# EAGLE schematic msi0010_new (EAGLE 6.1)

## Sheet 1 of 3
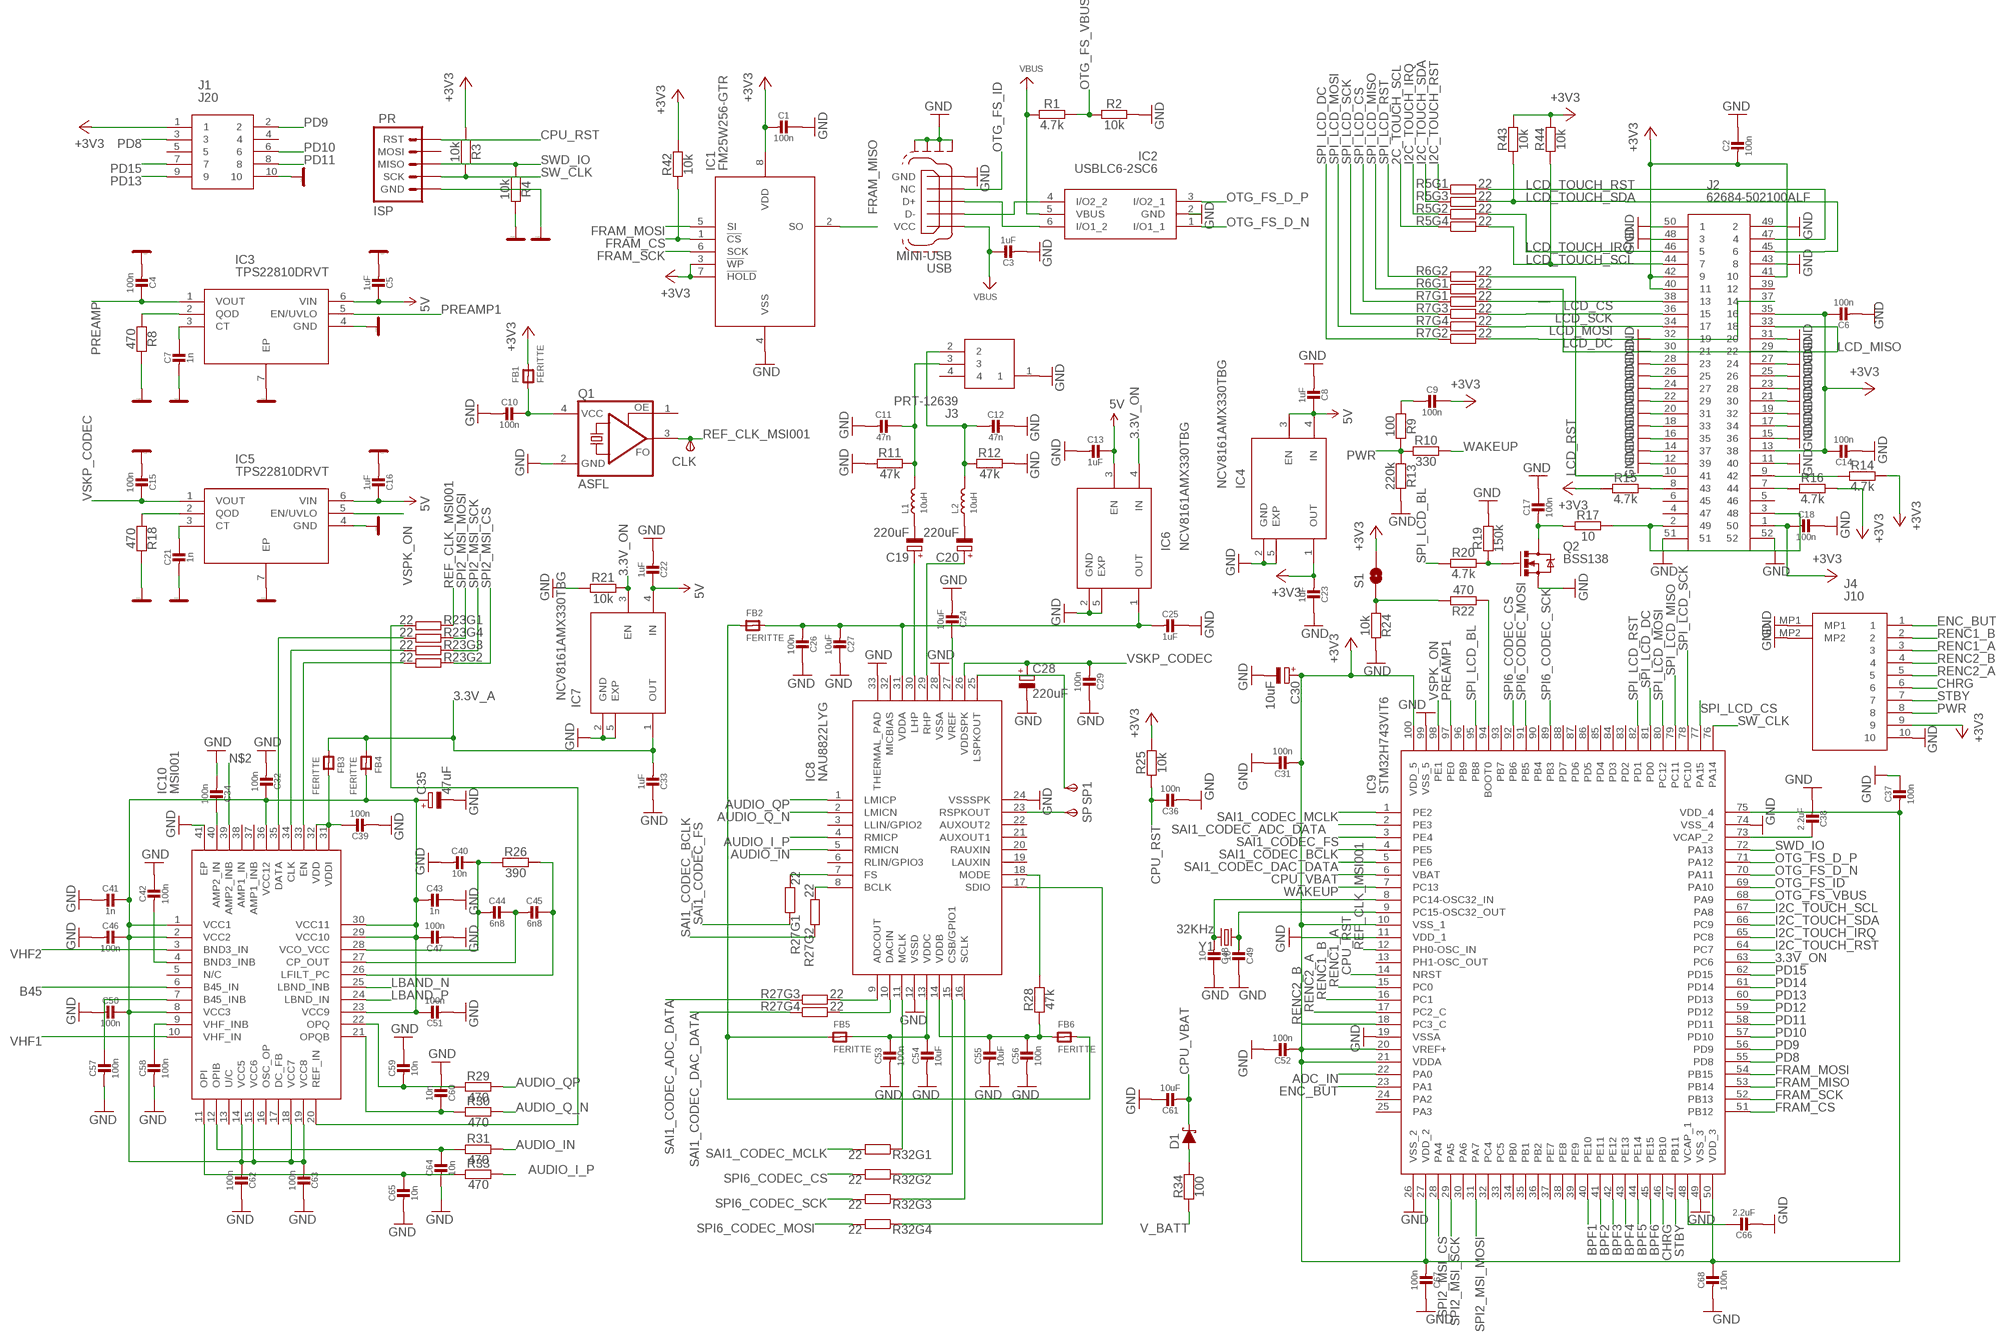
[diagram p0: schematic, sheet 1]

### Parts
C1  100n  CAP_CERAMIC_0402  [_0402]
C2  100n  CAP_CERAMIC_0402  [_0402]
C3  1uF  CAP_CERAMIC_0603  [_0603]
C4  100n  CAP_CERAMIC_0402  [_0402]
C5  1uF  CAP_CERAMIC_0603  [_0603]
C6  100n  CAP_CERAMIC_0402  [_0402]
C7  1n  CAP_CERAMIC_0402  [_0402]
C8  1uF  CAP_CERAMIC_0603  [_0603]
C9  100n  CAP_CERAMIC_0402  [_0402]
C10  100n  CAP_CERAMIC_0402  [_0402]
C11  47n  CAP_CERAMIC_0402  [_0402]
C12  47n  CAP_CERAMIC_0402  [_0402]
C13  1uF  CAP_CERAMIC_0603  [_0603]
C14  100n  CAP_CERAMIC_0402  [_0402]
C15  100n  CAP_CERAMIC_0402  [_0402]
C16  1uF  CAP_CERAMIC_0603  [_0603]
C17  100n  CAP_CERAMIC_0402  [_0402]
C18  100n  CAP_CERAMIC_0402  [_0402]
C19  220uF  CPOL-EUSANYO_A  [SANYO-OSCON_A]
C20  220uF  CPOL-EUSANYO_A  [SANYO-OSCON_A]
C21  1n  CAP_CERAMIC_0402  [_0402]
C22  1uF  CAP_CERAMIC_0603  [_0603]
C23  1uF  CAP_CERAMIC_0603  [_0603]
C24  10uF  CAP_CERAMIC_0402  [_0402]
C25  1uF  CAP_CERAMIC_0603  [_0603]
C26  100n  CAP_CERAMIC_0603  [_0603]
C27  10uF  CAP_CERAMIC_0402  [_0402]
C28  220uF  CPOL-EUSANYO_A  [SANYO-OSCON_A]
C29  100n  CAP_CERAMIC_0402  [_0402]
C30  10uF  CPOL-EUSMCA  [SMC_A]
C31  100n  CAP_CERAMIC_0402  [_0402]
C32  100n  CAP_CERAMIC_0402  [_0402]
C33  1uF  CAP_CERAMIC_0603  [_0603]
C34  100n  CAP_CERAMIC_0402  [_0402]
C35  47uF  CPOL-EUSMCA  [SMC_A]
C36  100n  CAP_CERAMIC_0402  [_0402]
C37  100n  CAP_CERAMIC_0402  [_0402]
C38  2.2uF  CAP_CERAMIC0805-NOTHERMALS  [0805_NOTHERMALS]
C39  100n  CAP_CERAMIC_0402  [_0402]
C40  10n  CAP_CERAMIC_0402  [_0402]
C41  1n  CAP_CERAMIC_0402  [_0402]
C42  100n  CAP_CERAMIC_0402  [_0402]
C43  1n  CAP_CERAMIC_0402  [_0402]
C44  6n8  CAP_CERAMIC_0402  [_0402]
C45  6n8  CAP_CERAMIC_0402  [_0402]
C46  100n  CAP_CERAMIC_0402  [_0402]
C47  100n  CAP_CERAMIC_0402  [_0402]
C48  10  CAP_CERAMIC_0402  [_0402]
C49  10  CAP_CERAMIC_0402  [_0402]
C50  100n  CAP_CERAMIC_0402  [_0402]
C51  100n  CAP_CERAMIC_0402  [_0402]
C52  100n  CAP_CERAMIC_0402  [_0402]
C53  100n  CAP_CERAMIC_0402  [_0402]
C54  10uF  CAP_CERAMIC_0603  [_0603]
C55  10uF  CAP_CERAMIC_0402  [_0402]
C56  100n  CAP_CERAMIC_0603  [_0603]
C57  100n  CAP_CERAMIC_0402  [_0402]
C58  100n  CAP_CERAMIC_0402  [_0402]
C59  10n  CAP_CERAMIC_0402  [_0402]
C60  10n  CAP_CERAMIC_0402  [_0402]
C61  10uF  CAP_CERAMIC_0402  [_0402]
C62  100n  CAP_CERAMIC_0402  [_0402]
C63  100n  CAP_CERAMIC_0402  [_0402]
C64  10n  CAP_CERAMIC_0402  [_0402]
C65  10n  CAP_CERAMIC_0402  [_0402]
C66  2.2uF  CAP_CERAMIC0805-NOTHERMALS  [0805_NOTHERMALS]
C67  100n  CAP_CERAMIC_0402  [_0402]
C68  100n  CAP_CERAMIC_0402  [_0402]
CLK  TPSTP13R  [TP13R]
D1  1A/40V/500mV  DIODE-SCHOTTKY-BAT20J  [SOD-323]
FB1  FERITTE  FERRITE_0603  [_0603]
FB2  FERITTE  FERRITE_0603  [_0603]
FB3  FERITTE  FERRITE_0603  [_0603]
FB4  FERITTE  FERRITE_0603  [_0603]
FB5  FERITTE  FERRITE_0603  [_0603]
FB6  FERITTE  FERRITE_0603  [_0603]
IC1  FM25W256-GTR  [SOT127P602X173-8N]
IC2  USBLC6-2SC6  [SOT95P280X145-6N]
IC3  TPS22810DRVT  [SON65P200X200X80-7N]
IC4  NCV8161AMX330TBG  NCP170AMX285TCG  [VREG_NCP170AMX285TCG]
IC5  TPS22810DRVT  [SON65P200X200X80-7N]
IC6  NCV8161AMX330TBG  NCP170AMX285TCG  [VREG_NCP170AMX285TCG]
IC7  NCV8161AMX330TBG  NCP170AMX285TCG  [VREG_NCP170AMX285TCG]
IC8  NAU8822LYG  [QFN50P500X500X80-33N]
IC9  STM32H743VIT6  [QFP50P1600X1600X160-100N]
IC10  MSI001  [QFN50P600X600X90-41N]
J1  J20  3220-10-0300-00-TR_3220-10-0300-00-TR  [3220-10-0300-00-TR_322010030000TR]
J2  62684-502100ALF  [62684502100ALF]
J3  PRT-12639  [PRT12639]
J4  J10  686120148922_686120148922  [686120148922_686120148922]
L1  10uH  INDUCTOR/FERRITE-BEAD-0805  [L0805@1]
L2  10uH  INDUCTOR/FERRITE-BEAD-0805  [L0805@1]
PR  ISP  SPARKFUN-CONNECTORS_PIC-ICSP-MINI  [SPARKFUN-CONNECTORS_PIC-ICSP-MINI]
Q1  ASFL  [ASF]
Q2  BSS138  MOSFET-NCHANNELBSS138  [SOT23-3]
R1  4.7k  RESISTORS-0402  [C0402]
R2  10k  RESISTORS-0402  [C0402]
R3  10k  RESISTORS-0402  [C0402]
R4  10k  RESISTORS-0402  [C0402]
R5  22  R_MATRIX_4ER_MATRIX_4_0402  [R_MATRIX_4_0402]
R6  22  R_MATRIX_4ER_MATRIX_4_0402  [R_MATRIX_4_0402]
R7  22  R_MATRIX_4ER_MATRIX_4_0402  [R_MATRIX_4_0402]
R8  470  RESISTORS-0402  [C0402]
R9  100  RESISTORS-0402  [C0402]
R10  330  RESISTORS-0402  [C0402]
R11  47k  RESISTORS-0402  [C0402]
R12  47k  RESISTORS-0402  [C0402]
R13  220k  RESISTORS-0402  [C0402]
R14  4.7k  RESISTORS-0402  [C0402]
R15  4.7k  RESISTORS-0402  [C0402]
R16  4.7k  RESISTORS-0402  [C0402]
R17  10  RESISTORS-0805  [C0805]
R18  470  RESISTORS-0402  [C0402]
R19  150k  RESISTORS-0402  [C0402]
R20  4.7k  RESISTORS-0402  [C0402]
R21  10k  RESISTORS-0402  [C0402]
R22  470  RESISTORS-0402  [C0402]
R23  22  R_MATRIX_4ER_MATRIX_4_0402  [R_MATRIX_4_0402]
R24  10k  RESISTORS-0402  [C0402]
R25  10k  RESISTORS-0402  [C0402]
R26  390  RESISTORS-0402  [C0402]
R27  22  R_MATRIX_4ER_MATRIX_4_0402  [R_MATRIX_4_0402]
R28  47k  RESISTORS-0402  [C0402]
R29  470  RESISTORS-0402  [C0402]
R30  470  RESISTORS-0402  [C0402]
R31  470  RESISTORS-0402  [C0402]
R32  22  R_MATRIX_4ER_MATRIX_4_0402  [R_MATRIX_4_0402]
R33  470  RESISTORS-0402  [C0402]
R34  100  RESISTORS-0402  [C0402]
R42  10k  RESISTORS-0402  [C0402]
R43  10k  RESISTORS-0402  [C0402]
R44  10k  RESISTORS-0402  [C0402]
S1  SOLDERJUMPERNO  [SJ_2S-NO]
SP  TPSTP15R  [TP15R]
SP1  TPSTP15R  [TP15R]
USB  MINI-USB  [MINI-USB-B5]
Y1  32KHz  CRYSTALMS3V  [CRYSTAL-32KHZ-MS3V]

### Nets
2C_TOUCH_SCL: R5.4.1
3.3V_A: C33.2 FB3.1 FB4.1 IC7.1(OUT) ; also sheet 2
3.3V_ON: IC6.4(IN) IC7.3(EN) IC9.63(PC6) R21.2
5V: C5.1 C8.1 C13.1 C16.1 C22.1 IC3.6(VIN) IC4.3(EN) IC4.4(IN) IC5.6(VIN) IC6.3(EN) IC7.4(IN) ; also sheet 3
+3V3: C1.2 C2.2 C6.1 C9.1 C14.1 C18.2 C23.2 C30.+ C31.2 C37.2 C52.2 C67.2 C68.1 FB1.2 IC1.3(!WP) IC1.7(!HOLD) IC1.8(VDD) IC4.1(OUT) IC9.10(VSS_1) IC9.20(VREF+) IC9.21(VDDA) IC9.27(VDD_2) IC9.50(VDD_3) IC9.75(VDD_4) IC9.100(VDD_5) J1.1 J2.1 J2.13 J2.35 J2.40 J2.41 J2.42 J4.9 R3.1 R14.2 R15.1 R16.2 R25.2 R42.2 R43.2 R44.2 S1.2 ; also sheet 2,3
-: IC8.25(LSPKOUT) SP1.TP(PP)
ADC_IN: IC9.22(PA0) ; also sheet 3
AUDIO_I_P: IC8.4(RMICP) R33.2
AUDIO_IN: IC8.5(RMICN) R31.2
AUDIO_Q_N: IC8.2(LMICN) R30.2
AUDIO_QP: IC8.1(LMICP) R29.2
B45: IC10.6(B45_IN) ; also sheet 2
BPF1: IC9.40(PE10) ; also sheet 2
BPF2: IC9.41(PE11) ; also sheet 2
BPF3: IC9.42(PE12) ; also sheet 2
BPF4: IC9.43(PE13) ; also sheet 2
BPF5: IC9.44(PE14) ; also sheet 2
BPF6: IC9.45(PE15) ; also sheet 2
CHRG: IC9.46(PB10) J4.6 ; also sheet 3
CPU_RST: C36.1 IC9.14(NRST) PR.1(RST) R25.1
CPU_VBAT: C61.2 D1.C IC9.6(VBAT)
ENC_BUT: IC9.23(PA1) J4.1
FRAM_CS: IC1.1(!CS) IC9.51(PB12) R42.1
FRAM_MISO: IC1.2(SO) IC9.53(PB14)
FRAM_MOSI: IC1.5(SI) IC9.54(PB15)
FRAM_SCK: IC1.6(SCK) IC9.52(PB13)
GND: C1.1 C2.1 C3.2 C4.2 C5.2 C6.2 C7.2 C8.2 C10.2 C11.2 C12.1 C13.2 C14.2 C15.2 C16.2 C17.1 C18.1 C21.2 C22.2 C23.1 C24.2 C25.1 C26.1 C27.1 C28.- C29.1 C30.- C31.1 C32.2 C33.1 C34.2 C35.- C36.2 C37.1 C38.2 C39.2 C40.2 C41.2 C42.1 C43.1 C46.2 C47.2 C48.1 C49.1 C50.2 C51.2 C52.1 C53.2 C54.2 C55.2 C56.2 C57.2 C58.2 C59.1 C60.2 C61.1 C62.1 C63.1 C64.2 C65.2 C66.2 C67.1 C68.2 IC1.4(VSS) IC2.2(GND) IC3.4(GND) IC3.7(EP) IC4.2(GND) IC4.5(EXP) IC5.4(GND) IC5.7(EP) IC6.2(GND) IC6.5(EXP) IC7.2(GND) IC7.5(EXP) IC8.12(VSSD) IC8.24(VSSSPK) IC8.28(VSSA) IC8.33(THERMAL_PAD) IC9.11(VDD_1) IC9.19(VSSA) IC9.26(VSS_2) IC9.49(VSS_3) IC9.74(VSS_4) IC9.99(VSS_5) IC10.41(EP) J1.10 J2.11 J2.12 J2.14 J2.15 J2.16 J2.17 J2.18 J2.19 J2.20 J2.21 J2.22 J2.23 J2.24 J2.25 J2.26 J2.27 J2.28 J2.29 J2.30 J2.31 J2.32 J2.43 J2.48 J2.49 J2.50 J2.51 J2.52 J3.1 J4.10 J4.MP1 J4.MP2 PR.5(GND) Q1.2(GND) Q2.2(S) R2.2 R4.2 R8.2 R11.1 R12.2 R13.2 R18.2 R19.2 R21.1 R24.2 USB.5(GND) USB.M1(S1) USB.M2(S2) USB.M3(S3) USB.M4(S4) ; also sheet 2,3
I2C_TOUCH_IRQ: IC9.65(PC8) R5.2.1
I2C_TOUCH_RST: IC9.64(PC7) R5.1.1
I2C_TOUCH_SCL: IC9.67(PA8)
I2C_TOUCH_SDA: IC9.66(PC9) R5.3.1
IO15: C48.2 IC9.8(PC14-OSC32_IN) Y1.P$2
IO16: C49.2 IC9.9(PC15-OSC32_OUT) Y1.P$1
LBAND_N: IC10.25(LBND_INB) ; also sheet 2
LBAND_P: IC10.24(LBND_IN) ; also sheet 2
LCD_CS: J2.38 R7.1.2
LCD_DC: J2.37 R7.2.2
LCD_MISO: J2.33 R6.1.2
LCD_MOSI: J2.34 R7.4.2
LCD_RST: J2.10 R6.2.2
LCD_SCK: J2.36 R7.3.2
LCD_TOUCH_IRQ: J2.46 R5.2.2
LCD_TOUCH_RST: J2.47 R5.1.2
LCD_TOUCH_SCL: J2.44 R5.4.2 R44.1
LCD_TOUCH_SDA: J2.45 R5.3.2 R43.1
N$1: C34.1 IC10.40(AMP2_IN)
N$2: IC10.39(AMP2_INB) ; also sheet 2
N$3: C39.1 FB3.2 IC10.31(VDDI) IC10.32(VDD)
N$5: C32.1 C35.+ C41.1 C43.2 C46.1 C47.1 C50.1 C51.1 C62.2 C63.2 FB4.2 IC10.1(VCC1) IC10.2(VCC2) IC10.8(VCC3) IC10.14(VCC5) IC10.15(VCC6) IC10.18(VCC7) IC10.19(VCC8) IC10.23(VCC9) IC10.29(VCC10) IC10.30(VCC11) IC10.36(VCC12)
N$6: C64.1 IC10.12(OPIB) R31.1
N$7: C65.1 IC10.11(OPI) R33.1
N$8: C60.1 IC10.21(OPQB) R30.1
N$9: C59.2 IC10.22(OPQ) R29.1
N$11: C21.1 IC5.3(CT)
N$17: C10.1 FB1.1 Q1.4(VCC)
N$26: C42.2 IC10.4(BND3_INB)
N$27: C58.1 IC10.9(VHF_INB)
N$28: C57.1 IC10.7(B45_INB)
N$29: IC10.33(EN) R23.2.2
N$30: IC10.34(CLK) R23.3.2
N$31: IC10.35(DATA) R23.4.2
N$32: C40.1 C44.2 IC10.28(VCO_VCC) R26.1
N$33: C44.1 C45.2 IC10.27(CP_OUT)
N$34: C45.1 IC10.26(LFILT_PC) R26.2
N$46: C19.+ IC8.30(LHP)
N$47: IC10.20(REF_IN) R23.1.2
N$48: C24.1 IC8.27(VREF)
N$49: C25.2 C26.2 C27.2 FB2.2 IC6.1(OUT) IC8.31(VDDA)
N$50: C53.1 C54.1 FB5.2 IC8.13(VDDC)
N$51: FB2.1 FB5.1 FB6.2
N$52: C55.1 C56.1 FB6.1 IC8.14(VDDB) R28.1
N$53: IC8.18(MODE) R28.2
N$54: C20.+ IC8.29(RHP)
N$55: IC8.7(FS) R27.1.2
N$56: IC8.8(BCLK) R27.2.2
N$57: IC8.9(ADCOUT) R27.3.2
N$58: IC8.10(DACIN) R27.4.2
N$59: C7.1 IC3.3(CT)
N$60: IC5.2(QOD) R18.1
N$61: IC8.15(CSB/GPIO1) R32.2.1
N$62: IC8.11(MCLK) R32.1.1
N$63: IC8.16(SCLK) R32.3.1
N$64: IC8.17(SDIO) R32.4.1
N$65: C19.- L1.1
N$66: C20.- L2.1
N$67: C12.2 J3.2 L2.2 R12.1
N$68: IC3.2(QOD) R8.1
N$69: C11.1 J3.3 L1.2 R11.2
N$70: IC2.6(I/O1_2) USB.3(D+)
N$73: J2.2 J2.3 R17.2
N$78: J2.7 R16.1
N$79: C17.2 Q2.3(D) R17.1
N$80: Q2.1(G) R19.1 R20.2
N$81: J2.9 R14.1
N$82: J2.8 R15.2
N$84: C66.1 IC9.48(VCAP_1)
N$85: C38.1 IC9.73(VCAP_2)
N$87: IC8.23(RSPKOUT) SP.TP(PP)
N$90: IC2.4(I/O2_2) USB.2(D-)
N$91: R22.2 R24.1 S1.1
N$92: IC9.94(BOOT0) R22.1
N$93: C9.2 R9.1
OTG_FS_D_N: IC2.1(I/O1_1) IC9.70(PA11)
OTG_FS_D_P: IC2.3(I/O2_1) IC9.71(PA12)
OTG_FS_ID: IC9.69(PA10) USB.4(NC)
OTG_FS_VBUS: IC9.68(PA9) R1.2 R2.1
PD8: IC9.55(PD8) J1.3
PD9: IC9.56(PD9) J1.2
PD10: IC9.57(PD10) J1.6
PD11: IC9.58(PD11) J1.8
PD12: IC9.59(PD12)
PD13: IC9.60(PD13) J1.9
PD14: IC9.61(PD14)
PD15: IC9.62(PD15) J1.7
PREAMP: C4.1 IC3.1(VOUT) ; also sheet 2
PREAMP1: IC3.5(EN/UVLO) IC9.97(PE0) ; also sheet 2
PWR: J4.8 R9.2 R10.1 R13.1
REF_CLK_MSI001: CLK.TP(PP) IC9.12(PH0-OSC_IN) Q1.3(FO) R23.1.1
RENC1_A: IC9.15(PC0) J4.3
RENC1_B: IC9.16(PC1) J4.2
RENC2_A: IC9.17(PC2_C) J4.5
RENC2_B: IC9.18(PC3_C) J4.4
SAI1_CODEC_ADC_DATA: IC9.2(PE3) R27.3.1
SAI1_CODEC_BCLK: IC9.4(PE5) R27.2.1
SAI1_CODEC_DAC_DATA: IC9.5(PE6) R27.4.1
SAI1_CODEC_FS: IC9.3(PE4) R27.1.1
SAI1_CODEC_MCLK: IC9.1(PE2) R32.1.2
SPI2_MSI_CS: IC9.28(PA4) R23.2.1
SPI2_MSI_MOSI: IC9.31(PA7) R23.4.1
SPI2_MSI_SCK: IC9.29(PA5) R23.3.1
SPI6_CODEC_CS: IC9.92(PB6) R32.2.2
SPI6_CODEC_MOSI: IC9.91(PB5) R32.4.2
SPI6_CODEC_SCK: IC9.89(PB3) R32.3.2
SPI_LCD_BL: IC9.95(PB8) R20.1
SPI_LCD_CS: IC9.77(PA15) R7.1.1
SPI_LCD_DC: IC9.81(PD0) R7.2.1
SPI_LCD_MISO: IC9.79(PC11) R6.1.1
SPI_LCD_MOSI: IC9.80(PC12) R7.4.1
SPI_LCD_RST: IC9.82(PD1) R6.2.1
SPI_LCD_SCK: IC9.78(PC10) R7.3.1
STBY: IC9.47(PB11) J4.7 ; also sheet 3
SW_CLK: IC9.76(PA14) PR.4(SCK) R3.2
SWD_IO: IC9.72(PA13) PR.3(MISO) R4.1
V_BATT: R34.1 ; also sheet 3
VBUS: C3.1 IC2.5(VBUS) R1.1 USB.1(VCC) ; also sheet 3
VBUS1: D1.A R34.2
VHF1: IC10.10(VHF_IN) ; also sheet 2
VHF2: IC10.3(BND3_IN) ; also sheet 2
VSKP_CODEC: C15.1 C28.+ C29.2 IC5.1(VOUT) IC8.26(VDDSPK)
VSPK_ON: IC5.5(EN/UVLO) IC9.98(PE1)
WAKEUP: IC9.7(PC13) R10.2
Unconnected: IC8.3(LLIN/GPIO2) IC8.6(RLIN/GPIO3) IC8.19(LAUXIN) IC8.20(RAUXIN) IC8.21(AUXOUT1) IC8.22(AUXOUT2) IC8.32(MICBIAS) IC9.13(PH1-OSC_OUT) IC9.24(PA2) IC9.25(PA3) IC9.30(PA6) IC9.32(PC4) IC9.33(PC5) IC9.34(PB0) IC9.35(PB1) IC9.36(PB2) IC9.37(PE7) IC9.38(PE8) IC9.39(PE9) IC9.83(PD2) IC9.84(PD3) IC9.85(PD4) IC9.86(PD5) IC9.87(PD6) IC9.88(PD7) IC9.90(PB4) IC9.93(PB7) IC9.96(PB9) IC10.5(N/C) IC10.13(U/C) IC10.16(OSC_OP) IC10.17(DC_FB) IC10.37(AMP1_INB) IC10.38(AMP1_IN) J1.4 J1.5 J2.4 J2.5 J2.6 J2.39 J3.4 PR.2(MOSI) Q1.1(OE) R6.3.1 R6.3.2 R6.4.1 R6.4.2

## Sheet 2 of 3
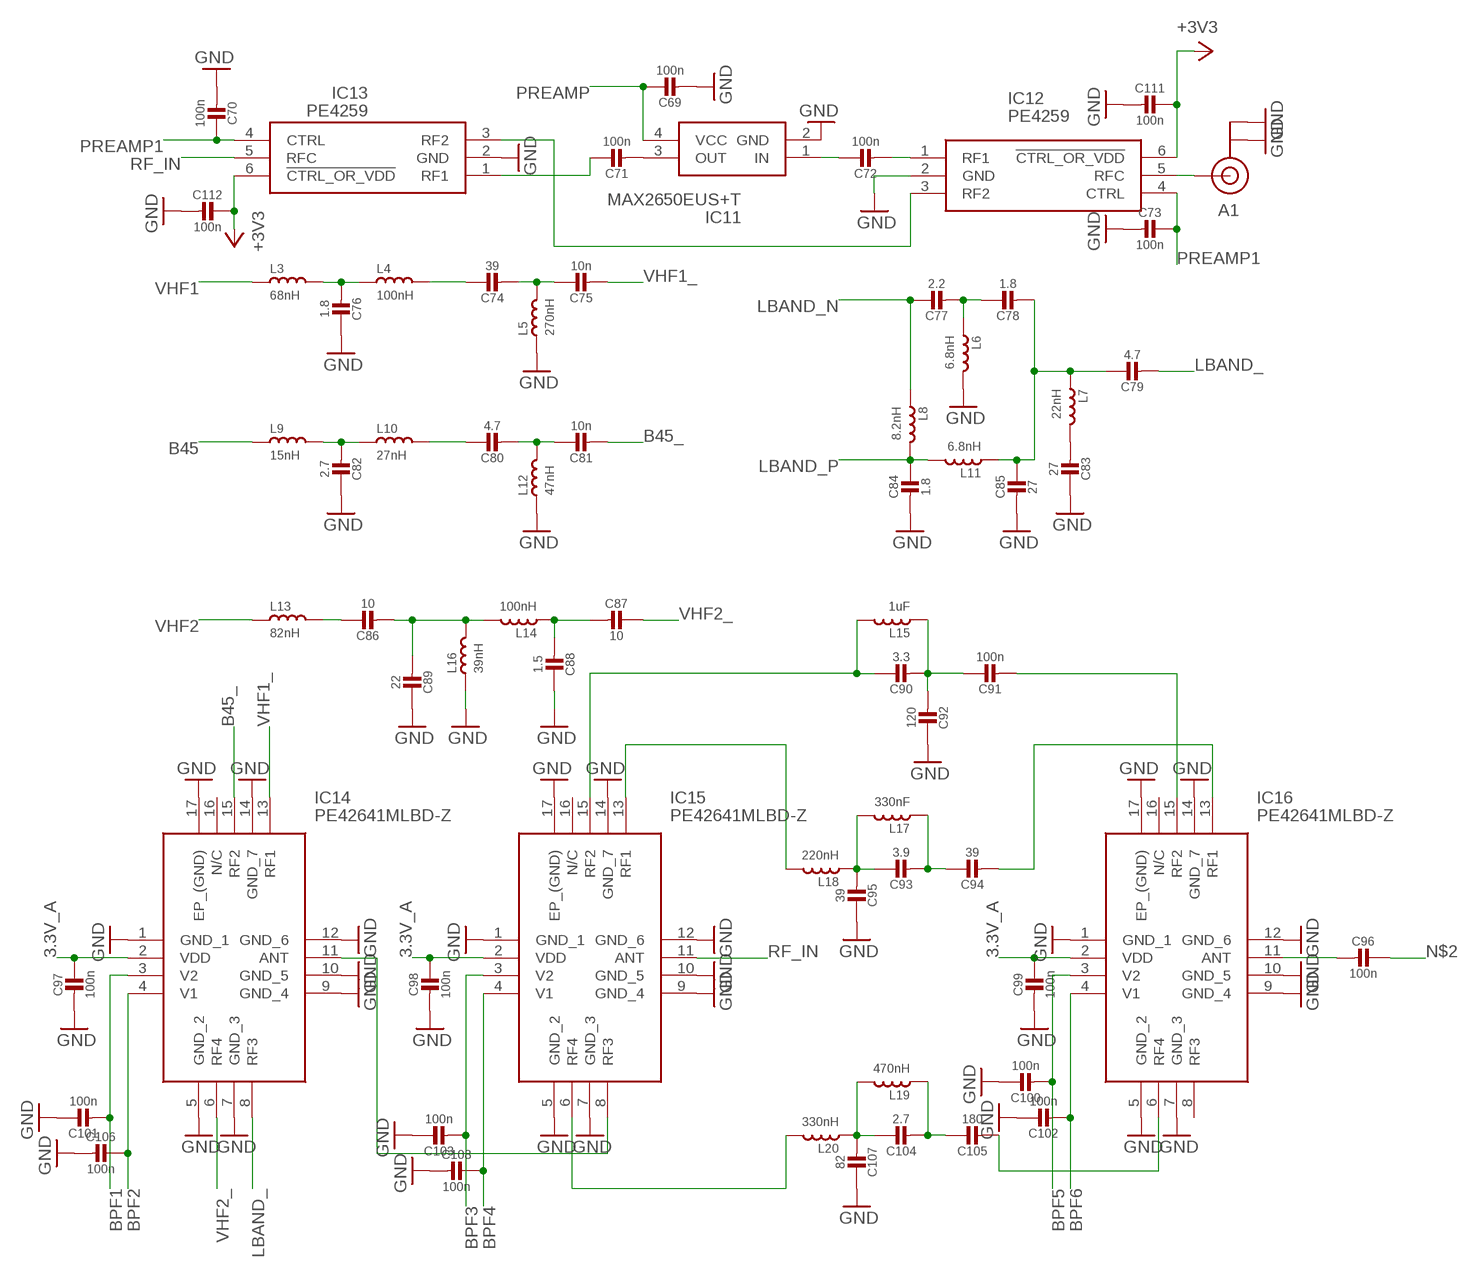
[diagram p1: schematic, sheet 2]

### Parts
A1  U.FL  [U.FL]
C69  100n  CAP_CERAMIC_0402  [_0402]
C70  100n  CAP_CERAMIC_0402  [_0402]
C71  100n  CAP_CERAMIC_0402  [_0402]
C72  100n  CAP_CERAMIC_0402  [_0402]
C73  100n  CAP_CERAMIC_0402  [_0402]
C74  39  CAP_CERAMIC_0402  [_0402]
C75  10n  CAP_CERAMIC_0402  [_0402]
C76  1.8  CAP_CERAMIC_0402  [_0402]
C77  2.2  CAP_CERAMIC_0402  [_0402]
C78  1.8  CAP_CERAMIC_0402  [_0402]
C79  4.7  CAP_CERAMIC_0402  [_0402]
C80  4.7  CAP_CERAMIC_0402  [_0402]
C81  10n  CAP_CERAMIC_0402  [_0402]
C82  2.7  CAP_CERAMIC_0402  [_0402]
C83  27  CAP_CERAMIC_0402  [_0402]
C84  1.8  CAP_CERAMIC_0402  [_0402]
C85  27  CAP_CERAMIC_0402  [_0402]
C86  10  CAP_CERAMIC_0402  [_0402]
C87  10  CAP_CERAMIC_0402  [_0402]
C88  1.5  CAP_CERAMIC_0402  [_0402]
C89  22  CAP_CERAMIC_0402  [_0402]
C90  3.3  CAP_CERAMIC_0402  [_0402]
C91  100n  CAP_CERAMIC_0402  [_0402]
C92  120  CAP_CERAMIC_0402  [_0402]
C93  3.9  CAP_CERAMIC_0402  [_0402]
C94  39  CAP_CERAMIC_0402  [_0402]
C95  39  CAP_CERAMIC_0402  [_0402]
C96  100n  CAP_CERAMIC_0402  [_0402]
C97  100n  CAP_CERAMIC_0402  [_0402]
C98  100n  CAP_CERAMIC_0402  [_0402]
C99  100n  CAP_CERAMIC_0402  [_0402]
C100  100n  CAP_CERAMIC_0402  [_0402]
C101  100n  CAP_CERAMIC_0402  [_0402]
C102  100n  CAP_CERAMIC_0402  [_0402]
C103  100n  CAP_CERAMIC_0402  [_0402]
C104  2.7  CAP_CERAMIC_0402  [_0402]
C105  180  CAP_CERAMIC_0402  [_0402]
C106  100n  CAP_CERAMIC_0402  [_0402]
C107  82  CAP_CERAMIC_0402  [_0402]
C108  100n  CAP_CERAMIC_0402  [_0402]
C111  100n  CAP_CERAMIC_0402  [_0402]
C112  100n  CAP_CERAMIC_0402  [_0402]
IC11  MAX2650EUS+T  [4-SOT143]
IC12  PE4259  [SOT65P210X110-6N]
IC13  PE4259  [SOT65P210X110-6N]
IC14  PE42641MLBD-Z  [QFN50P300X300X80-17N]
IC15  PE42641MLBD-Z  [QFN50P300X300X80-17N]
IC16  PE42641MLBD-Z  [QFN50P300X300X80-17N]
L3  68nH  INDUCTOR/FERRITE-BEAD-0603  [L0603@1]
L4  100nH  INDUCTOR/FERRITE-BEAD-0603  [L0603@1]
L5  270nH  INDUCTOR/FERRITE-BEAD-0603  [L0603@1]
L6  6.8nH  INDUCTOR/FERRITE-BEAD-0402  [L0402@1]
L7  22nH  INDUCTOR/FERRITE-BEAD-0402  [L0402@1]
L8  8.2nH  INDUCTOR/FERRITE-BEAD-0402  [L0402@1]
L9  15nH  INDUCTOR/FERRITE-BEAD-0402  [L0402@1]
L10  27nH  INDUCTOR/FERRITE-BEAD-0402  [L0402@1]
L11  6.8nH  INDUCTOR/FERRITE-BEAD-0402  [L0402@1]
L12  47nH  INDUCTOR/FERRITE-BEAD-0402  [L0402@1]
L13  82nH  INDUCTOR/FERRITE-BEAD-0603  [L0603@1]
L14  100nH  INDUCTOR/FERRITE-BEAD-0402  [L0402@1]
L15  1uF  INDUCTOR/FERRITE-BEAD-0805  [L0805@1]
L16  39nH  INDUCTOR/FERRITE-BEAD-0402  [L0402@1]
L17  330nF  INDUCTOR/FERRITE-BEAD-0603  [L0603@1]
L18  220nH  INDUCTOR/FERRITE-BEAD-0603  [L0603@1]
L19  470nH  INDUCTOR/FERRITE-BEAD-0603  [L0603@1]
L20  330nH  INDUCTOR/FERRITE-BEAD-0603  [L0603@1]

### Nets
3.3V_A: C97.1 C98.1 C99.1 IC14.2(VDD) IC15.2(VDD) IC16.2(VDD) ; also sheet 1
+3V3: C111.1 C112.1 IC12.6(!CTRL_OR_VDD) IC13.6(!CTRL_OR_VDD) ; also sheet 1,3
B45: L9.1 ; also sheet 1
B45_: C81.2 IC14.15(RF2)
BPF1: C101.2 IC14.3(V2) ; also sheet 1
BPF2: C106.1 IC14.4(V1) ; also sheet 1
BPF3: C103.2 IC15.3(V2) ; also sheet 1
BPF4: C108.1 IC15.4(V1) ; also sheet 1
BPF5: C100.2 IC16.3(V2) ; also sheet 1
BPF6: C102.2 IC16.4(V1) ; also sheet 1
GND: A1.P$1(GND) A1.P$2(GND) C69.2 C70.2 C73.2 C76.1 C82.1 C83.1 C84.2 C85.2 C88.1 C89.1 C92.1 C95.1 C97.2 C98.2 C99.2 C100.1 C101.1 C102.1 C103.1 C106.2 C107.1 C108.2 C111.2 C112.2 IC11.2(GND) IC12.2(GND) IC13.2(GND) IC14.1(GND_1) IC14.5(GND_2) IC14.7(GND_3) IC14.9(GND_4) IC14.10(GND_5) IC14.12(GND_6) IC14.14(GND_7) IC14.17(EP_(GND)) IC15.1(GND_1) IC15.5(GND_2) IC15.7(GND_3) IC15.9(GND_4) IC15.10(GND_5) IC15.12(GND_6) IC15.14(GND_7) IC15.17(EP_(GND)) IC16.1(GND_1) IC16.5(GND_2) IC16.7(GND_3) IC16.9(GND_4) IC16.10(GND_5) IC16.12(GND_6) IC16.14(GND_7) IC16.17(EP_(GND)) L5.1 L6.2 L12.1 L16.1 ; also sheet 1,3
LBAND_: C79.2 IC14.8(RF3)
LBAND_N: C77.1 L8.1 ; also sheet 1
LBAND_P: C84.1 L8.2 L11.2 ; also sheet 1
N$2: C96.1 ; also sheet 1
N$4: C71.1 IC13.1(RF1)
N$10: C82.2 L9.2 L10.1
N$12: C78.2 C79.1 C85.1 L7.1 L11.1
N$13: C80.1 L10.2
N$14: C77.2 C78.1 L6.1
N$15: C83.2 L7.2
N$16: C80.2 C81.1 L12.2
N$18: C76.2 L3.2 L4.1
N$19: C74.1 L4.2
N$20: C74.2 C75.1 L5.2
N$21: IC14.11(ANT) IC15.8(RF3)
N$22: C86.1 L13.2
N$23: C86.2 C89.2 L14.2 L16.2
N$24: C87.2 C88.2 L14.1
N$25: C90.1 IC15.15(RF2) L15.2
N$35: C90.2 C91.1 C92.2 L15.1
N$36: C72.1 IC11.1(IN)
N$37: C91.2 IC16.15(RF2)
N$38: C104.1 C107.2 L19.2 L20.1
N$39: C104.2 C105.1 L19.1
N$40: IC15.6(RF4) L20.2
N$41: C105.2 IC16.6(RF4)
N$42: C93.1 C95.2 L17.2 L18.1
N$43: C93.2 C94.1 L17.1
N$44: IC15.13(RF1) L18.2
N$45: C94.2 IC16.13(RF1)
N$72: C71.2 IC11.3(OUT)
N$75: C72.2 IC12.1(RF1)
N$77: A1.P$3(SIGNAL) IC12.5(RFC)
N$86: C96.2 IC16.11(ANT)
N$94: IC12.3(RF2) IC13.3(RF2)
PREAMP: C69.1 IC11.4(VCC) ; also sheet 1
PREAMP1: C70.1 C73.1 IC12.4(CTRL) IC13.4(CTRL) ; also sheet 1
RF_IN: IC13.5(RFC) IC15.11(ANT)
VHF1: L3.1 ; also sheet 1
VHF1_: C75.2 IC14.13(RF1)
VHF2: L13.1 ; also sheet 1
VHF2_: C87.1 IC14.6(RF4)
Unconnected: IC14.16(N/C) IC15.16(N/C) IC16.8(RF3) IC16.16(N/C)

## Sheet 3 of 3
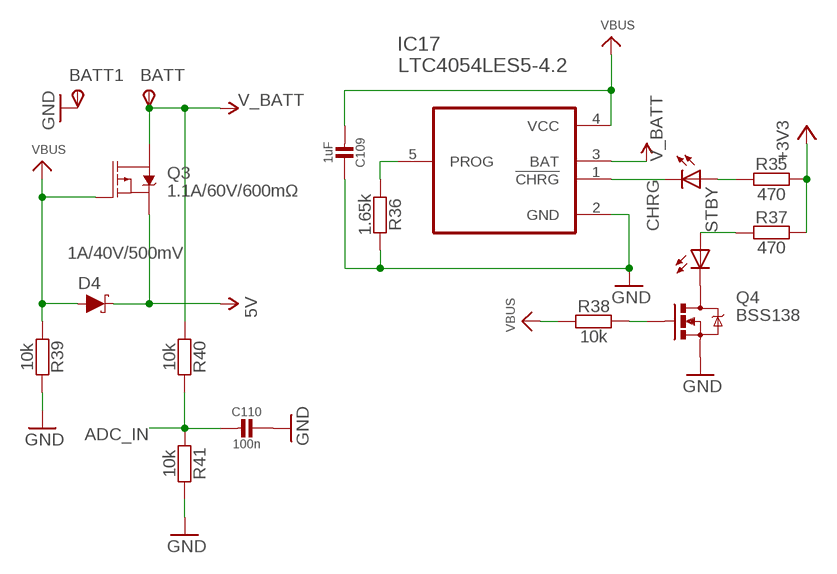
[diagram p2: schematic, sheet 3]

### Parts
BATT  TPSTP13R  [TP13R]
BATT1  TPSTP13R  [TP13R]
C109  1uF  CAP_CERAMIC_0603  [_0603]
C110  100n  CAP_CERAMIC_0402  [_0402]
D2  1 led  LED0603  [LED-0603]
D3  1 led  LED0603  [LED-0603]
D4  1A/40V/500mV  DIODE-SCHOTTKY-BAT20J  [SOD-323]
IC17  LTC4054LES5-4.2  LTC4054LES5-4.2#TRPBF  [SOT95P280X100-5N]
Q3  1.1A/60V/600mΩ  MOSFET_PCH-SI2309DS  [SOT23-3@1]
Q4  BSS138  MOSFET-NCHANNELBSS138  [SOT23-3]
R35  470  RESISTORS-0402  [C0402]
R36  1.65k  RESISTORS-0402  [C0402]
R37  470  RESISTORS-0402  [C0402]
R38  10k  RESISTORS-0402  [C0402]
R39  10k  RESISTORS-0402  [C0402]
R40  10k  RESISTORS-0402  [C0402]
R41  10k  RESISTORS-0402  [C0402]

### Nets
5V: D4.C Q3.2(S) ; also sheet 1
+3V3: R35.2 R37.2 ; also sheet 1,2
ADC_IN: C110.2 R40.2 R41.1 ; also sheet 1
CHRG: D2.C IC17.1(!CHRG) ; also sheet 1
GND: BATT1.TP(PP) C109.1 C110.1 IC17.2(GND) Q4.2(S) R36.2 R39.2 R41.2 ; also sheet 1,2
N$74: IC17.5(PROG) R36.1
N$76: D2.A R35.1
N$83: D3.C Q4.3(D)
N$89: Q4.1(G) R38.2
STBY: D3.A R37.1 ; also sheet 1
V_BATT: BATT.TP(PP) IC17.3(BAT) Q3.3(D) R40.1 ; also sheet 1
VBUS: C109.2 D4.A IC17.4(VCC) Q3.1(G) R38.1 R39.1 ; also sheet 1

## Library data of the parts
A1 = SparkFun_ESP8266_Thing:U.FL: SMD antenna connector- WRL-09144; PROD_ID: CONN-09193
BATT BATT1 CLK SP SP1 = testpad:TPS: TEST PIN
C1-C18 C21-C27 C29 C31-C34 C36-C112 = microbuilder:CAP_CERAMIC: Ceramic Capacitors For new designs, use the packages preceded by an '_' character since they are more reliable: The following footprints should be used on most boards: _0402 - Standard footprint for regular board layouts _0603 - Standard footprint for regular board layouts _0805 - Standard footprint for regular board layouts _1206 - Standard footprint for regular board layouts For extremely tight-pitch boards where space is at a premium, the following 'micro-pitch' footprints can be used (smaller pads, no silkscreen outline, etc.): _0402MP - Micro-pitch footprint for very dense/compact boards _0603MP - Micro-pitch footprint for very dense/compact boards _0805MP - Micro-pitch footprint for very dense/compact boards _1206MP - Micro-pitch footprint for very dense/compact boards
C19 C20 C28 C30 C35 = rcl:CPOL-EU: POLARIZED CAPACITOR, European symbol
D1 D4 = SparkFun-DiscreteSemi:DIODE-SCHOTTKY: Schottky diode A Schottky diode is a semiconductor diode which has a low forward voltage drop and a very fast switching action.; PROD_ID: DIO-11623; VALUE: 1A/23V/620mV
D2 D3 = SparkFun:LED: LEDs Standard schematic elements and footprints for 5mm, 3mm, 1206, and 0603 sized LEDs. 5mm - Spark Fun Electronics SKU : COM-00529 (and others)
FB1-FB6 = microbuilder:FERRITE: Ferrite Bead 0603 MMZ1608B121C - 120 Ohm @ 100MHz, 600mA, 0.15 Ohm DC Resistance - Digikey: 445-2164-1-ND BK1608HW121-T - 120 Ohm, 600mA Ferrite Chip - Digikey: 587-1876-2-ND 0805 HZ0805B272R-10 - 2.7K Ohm @ 100MHz, 200mA, 0.8 Ohm DC Resistance - Digikey: 240-2504-1-ND (see also Murata BLM21BD272SN1L) MMZ2012Y152B - 1.5K Ohm @ 100MHz, 500mA, 0.4 Ohm DC Resistance - Digikey: 445-1560-1-ND - Mainly for high frequency (80-400MHz) MMZ2012R102A - 1K Ohm @ 100MHz, 500mA, 0.3 Ohm DC Resistance - Digikey: 445-1555-2-ND - More general purpose (10-200MHz)
IC1 = FM25W256-GTR:FM25W256-GTR: CYPRESS SEMICONDUCTOR - FM25W256-GTR - F-RAM, NON-VOL, 256KBIT, 20MHZ, SOIC-8 Source: Datasheet <https://componentsearchengine.com/Datasheets/2/FM25W256-GTR.pdf>; ARROW_PART_NUMBER: FM25W256-GTR; ARROW_PRICE-STOCK: https://www.arrow.com/en/products/fm25w256-gtr/cypress-semiconductor?region=nac; DESCRIPTION: CYPRESS SEMICONDUCTOR - FM25W256-GTR - F-RAM, NON-VOL, 256KBIT, 20MHZ, SOIC-8; HEIGHT: 1.727mm; MANUFACTURER_NAME: Cypress Semiconductor; MANUFACTURER_PART_NUMBER: FM25W256-GTR; MOUSER_PART_NUMBER: 877-FM25W256-GTR; MOUSER_PRICE-STOCK: https://www.mouser.co.uk/ProductDetail/Cypress-Semiconductor/FM25W256-GTR?qs=pA5MXup5wxGoDW6i2AFyWw%3D%3D
IC2 = SamacSys_Parts:USBLC6-2SC6: TVS Diode Array Uni-Directional USBLC6-2SC6 17V, SOT-23 6-Pin Source: Datasheet <http://www.st.com/st-web-ui/static/active/en/resource/technical/document/datasheet/CD00050750.pdf>; ARROW_PART_NUMBER: USBLC6-2SC6; ARROW_PRICE-STOCK: https://www.arrow.com/en/products/usblc6-2sc6/stmicroelectronics; DESCRIPTION: TVS Diode Array Uni-Directional USBLC6-2SC6 17V, SOT-23 6-Pin; HEIGHT: 1.45mm; MANUFACTURER_NAME: STMicroelectronics; MANUFACTURER_PART_NUMBER: USBLC6-2SC6; MOUSER_PART_NUMBER: 511-USBLC6-2SC6; MOUSER_PRICE-STOCK: https://www.mouser.co.uk/ProductDetail/STMicroelectronics/USBLC6-2SC6/?qs=po45yt2pPpu%2FhNIlwQdTlg%3D%3D
IC3 IC5 = TPS22810DRVT:TPS22810DRVT: 18V, 3A, 79m load switch with adjustable rise time, adj. quick output discharge, & thermal shutdown Source: Datasheet <http://www.ti.com/general/docs/lit/getliterature.tsp?genericPartNumber=TPS22810&fileType=pdf>; ARROW_PART_NUMBER: TPS22810DRVT; ARROW_PRICE-STOCK: https://www.arrow.com/en/products/tps22810drvt/texas-instruments?region=nac; DESCRIPTION: 18V, 3A, 79m load switch with adjustable rise time, adj. quick output discharge, & thermal shutdown; HEIGHT: 0.8mm; MANUFACTURER_NAME: Texas Instruments; MANUFACTURER_PART_NUMBER: TPS22810DRVT; MOUSER_PART_NUMBER: 595-TPS22810DRVT; MOUSER_PRICE-STOCK: https://www.mouser.co.uk/ProductDetail/Texas-Instruments/TPS22810DRVT?qs=5aG0NVq1C4wtEcND0E9Qlg%3D%3D
IC4 IC6 IC7 = NCP170AMX285TCG:NCP170AMX285TCG: Linear Voltage Regulator IC 1 Output 150mA 4-XDFN (1x1); MANUFACTURER: ON Semiconductor; MAXIMUM_PACKAGE_HEIGHT: 0.43 mm; PARTREV: A; STANDARD: Manufacturer Recommendations
IC8 = NAU8822LYG:NAU8822LYG: IC AUDIO CODEC STEREO 32QFN Source: Datasheet <http://www.nuvoton.com/resource-files/NAU8822LDataSheetRev1.9.pdf>; ARROW_PART_NUMBER: NAU8822LYG; ARROW_PRICE-STOCK: https://www.arrow.com/en/products/nau8822lyg/nuvoton-technology; DESCRIPTION: IC AUDIO CODEC STEREO 32QFN; HEIGHT: 0.8mm; MANUFACTURER_NAME: Nuvoton; MANUFACTURER_PART_NUMBER: NAU8822LYG
IC9 = STM32H743VIT6:STM32H743VIT6: ARM Microcontrollers - MCU High-performance and DSP with DP-FPU, ARM Cortex-M7 MCU with 2MBytes Flash, 1MB RAM, 400 MHz CPU, Art Accelerator, L1 cache, external memory interface, large set of peripherals Source: Datasheet <https://www.st.com/resource/en/datasheet/stm32h743vi.pdf>; ARROW_PART_NUMBER: STM32H743VIT6; ARROW_PRICE-STOCK: https://www.arrow.com/en/products/stm32h743vit6/stmicroelectronics?region=nac; DESCRIPTION: ARM Microcontrollers - MCU High-performance and DSP with DP-FPU, ARM Cortex-M7 MCU with 2MBytes Flash, 1MB RAM, 400 MHz CPU, Art Accelerator, L1 cache, external memory interface, large set of peripherals; HEIGHT: 1.6mm; MANUFACTURER_NAME: STMicroelectronics; MANUFACTURER_PART_NUMBER: STM32H743VIT6; MOUSER_PART_NUMBER: 511-STM32H743VIT6; MOUSER_PRICE-STOCK: https://www.mouser.co.uk/ProductDetail/STMicroelectronics/STM32H743VIT6?qs=FNcb6ahWXRw0Me5k2ZHgWw%3D%3D
IC10 = MSI001:MSI001: Multi-mode Tuner Source: Datasheet <http://sdr.lt/~hexx/MSi001_Datasheet_R3P3.pdf>; DESCRIPTION: Multi-mode Tuner; HEIGHT: 0.9mm; MANUFACTURER_NAME: MIRICS; MANUFACTURER_PART_NUMBER: MSI001
IC11 = MAX2650EUS+T:MAX2650EUS+T: MAXIM INTEGRATED PRODUCTS - MAX2650EUS+T - RF AMP, DC-1GHZ, 18.3DB, SOT-143-4 Source: Datasheet <https://componentsearchengine.com/Datasheets/2/MAX2650EUS T.pdf>; DESCRIPTION: MAXIM INTEGRATED PRODUCTS - MAX2650EUS+T - RF AMP, DC-1GHZ, 18.3DB, SOT-143-4; HEIGHT: mm; MANUFACTURER_NAME: Maxim Integrated; MANUFACTURER_PART_NUMBER: MAX2650EUS+T; MOUSER_PART_NUMBER: 700-MAX2650EUS+T; MOUSER_PRICE-STOCK: https://www.mouser.com/Search/Refine.aspx?Keyword=700-MAX2650EUS%2BT
IC12 IC13 = PE4259:PE4259: PART NUMBER ONLY Source: Datasheet <https://datasheet.datasheetarchive.com/originals/distributors/SFDatasheet-2/sf-00045491.pdf>; DESCRIPTION: PART NUMBER ONLY; HEIGHT: 1.1mm; MANUFACTURER_NAME: Peregrine Semiconductor; MANUFACTURER_PART_NUMBER: PE4259; MOUSER_PART_NUMBER: N/A; MOUSER_PRICE-STOCK: https://www.mouser.co.uk/ProductDetail/pSemi/PE4259?qs=HXFqYaX1Q2z4M17diTt2%252BA%3D%3D
IC14-IC16 = PE42641MLBD-Z:PE42641MLBD-Z: IC RF SWITCH SP4T 50 OHM 16QFN Source: Datasheet <http://www.psemi.com/pdf/datasheets/pe42641ds.pdf>; DESCRIPTION: IC RF SWITCH SP4T 50 OHM 16QFN; HEIGHT: 0.8mm; MANUFACTURER_NAME: Peregrine Semiconductor; MANUFACTURER_PART_NUMBER: PE42641MLBD-Z; MOUSER_PART_NUMBER: 81-PE42641MLBD-Z; MOUSER_PRICE-STOCK: https://www.mouser.co.uk/ProductDetail/pSemi/PE42641MLBD-Z?qs=iw0hurA%2FaD2FjY5MKcciag%3D%3D
IC17 = LTC4054LES5-4.2_TRPBF:LTC4054LES5-4.2#TRPBF: LTC4054L-4.2 - 150mA Standalone Linear Li-Ion Battery Charger in ThinSOT; DESCRIPTION: LTC4054L-4.2 - 150mA Standalone Linear Li-Ion Battery Charger in ThinSOT; DIGI-KEY_PART_NUMBER: LTC4054LES5-4.2#TRPBFCT-ND; DIGI-KEY_PURCHASE_URL: https://www.digikey.co.id/product-detail/en/linear-technology-analog-devices/LTC4054LES5-4.2-TRPBF/LTC4054LES5-4.2-TRPBFCT-ND/1888452?utm_source=snapeda&utm_medium=aggregator&utm_campaign=symbol; MF: Linear Technology/Analog; MP: LTC4054LES5-4.2#TRPBF; PACKAGE: SOT-23-5 Linear Technology
J1 = mosquito:3220-10-0300-00-TR_3220-10-0300-00-TR: Conn Shrouded Header HDR 10 POS 1.27mm Solder ST SMD T/R Source: Datasheet <http://www.cnctech.us/pdfs/3220-XX-0300-00-TR.pdf>; ARROW_PART_NUMBER: 3220-10-0300-00-TR; ARROW_PRICE-STOCK: https://www.arrow.com/en/products/3220-10-0300-00-tr/cnc-tech-llc?region=nac; DESCRIPTION: Conn Shrouded Header HDR 10 POS 1.27mm Solder ST SMD T/R; HEIGHT: 5.55mm; MANUFACTURER_NAME: CNC Tech; MANUFACTURER_PART_NUMBER: 3220-10-0300-00-TR
J2 = SamacSys_Parts:62684-502100ALF: FCI,Receptacle FPC/FFC 50 way FCI OPU Series 0.5mm Pitch 50 Way 1 Row Right Angle Female FPC Connector with No, Gold Flash Plated Contacts Source: Datasheet <http://cdn.amphenol-icc.com/media/wysiwyg/files/drawing/62684.pdf>; ALLIED_NUMBER: 70236843; ALLIED_PRICE-STOCK: https://www.alliedelec.com/amphenol-fci-62684-502100alf/70236843/; DESCRIPTION: FCI,Receptacle FPC/FFC 50 way FCI OPU Series 0.5mm Pitch 50 Way 1 Row Right Angle Female FPC Connector with No, Gold Flash Plated Contacts; HEIGHT: 2mm; MANUFACTURER_NAME: FCI; MANUFACTURER_PART_NUMBER: 62684-502100ALF; MOUSER_PART_NUMBER: 649-62684-502100ALF; MOUSER_PRICE-STOCK: https://www.mouser.com/Search/Refine.aspx?Keyword=649-62684-502100ALF; RS_PART_NUMBER: 8633380; RS_PRICE-STOCK: https://uk.rs-online.com/web/p/products/8633380
J3 = PRT-12639:PRT-12639: SparkFun Accessories Audio Jack - 3.5mm TRRS (SMD) Source: Datasheet <http://cdn.sparkfun.com/datasheets/Prototyping/20153.pdf>; ARROW_PART_NUMBER: PRT-12639; ARROW_PRICE-STOCK: https://www.arrow.com/en/products/prt-12639/sparkfun-electronics?region=nac; DESCRIPTION: SparkFun Accessories Audio Jack - 3.5mm TRRS (SMD); HEIGHT: 5.3mm; MANUFACTURER_NAME: SparkFun; MANUFACTURER_PART_NUMBER: PRT-12639; MOUSER_PART_NUMBER: 474-PRT-12639; MOUSER_PRICE-STOCK: https://www.mouser.co.uk/ProductDetail/SparkFun/PRT-12639?qs=WyAARYrbSnautCwYhJcFjA%3D%3D
J4 = msi0010_new:686120148922_686120148922: WR-FPC 1.0mm ZIF SMT FPC connector, 20P Source: Datasheet <https://katalog.we-online.de/em/datasheet/6861xx148922.pdf>; DESCRIPTION: WR-FPC 1.0mm ZIF SMT FPC connector, 20P; HEIGHT: 4mm; MANUFACTURER_NAME: Wurth Elektronik; MANUFACTURER_PART_NUMBER: 686120148922; MOUSER_PART_NUMBER: 710-686120148922; MOUSER_PRICE-STOCK: https://www.mouser.co.uk/ProductDetail/Wurth-Elektronik/686120148922?qs=a9WhcLg8qCyvYmrYQqStPQ%3D%3D
L1-L20 = Discrete:INDUCTOR/FERRITE-BEAD
PR = snaige:SPARKFUN-CONNECTORS_PIC-ICSP-MINI: PIC-ICSP-Mini Miniature 5-pin connection for temporary programming of PICs. Use this device in your design to save space. Program the PIC with this adapter Spark Fun Electronics SKU : BOB-00194
Q1 = crystal:ASF*: CRYSTAL CLOCK OSCILLATORS 5.0 Vdc or 3.3 Vdc - LOW PROFILE ULTRA MINIATURE CERAMIC SURFACE MOUNT Source: http://www.abracon.com/Oscillators/asf1-L-L1.pdf
Q2 Q4 = SparkFun-DiscreteSemi:MOSFET-NCHANNEL: Common NMOSFET Parts MFG P/N Store ID Prod ID FDD8780 TRANS-09984 SI7820DN TRANS-11055 FDS6630A IC-08089 2N7002PW TRANS-11151 FQP30N06L COM-10213 TRANS-10060 BSS123LT1G TRANS-08345 BSS138 TRANS-00830 BS170 2N7000; PROD_ID: TRANS-00830; VALUE: 200mA/50V
Q3 = SparkFun-DiscreteSemi:MOSFET_PCH: P-channel MOSFETs Voltage controlled devices that allow control of high current outputs. SparkFun Products: SparkFun ESP32 Thing <https://www.sparkfun.com/products/13907> SparkFun ESP8266 Thing <https://www.sparkfun.com/products/13231>; PROD_ID: TRANS-08285
R1-R4 R8-R22 R24-R26 R28-R31 R33-R44 = Arduino:RESISTORS: Resistors all kinds in 0603 and 0402
R5-R7 R23 R27 R32 = OLIMEX_DISCRET:R_MATRIX_4E
S1 = SparkFun:SOLDERJUMPER: Solder Jumper Standard SMD solder jumper. Used to automate production. Two varients : Normally Open and Normally Closed are the same, but have different paste layers. NC will have a large amount of paste and should jumper during reflow.
USB = fifisdr:MINI-USB: Mini-USB-Buchse 5 pol mit Schirm
Y1 = ehl:CRYSTAL: Crystals Various standard crystals. Proven footprints. Spark Fun Electronics SKU : COM-00534

## Net classes
0 default: width 0.3 mm
1 USB: width 0.406 mm
2 gnd: width 0.254 mm, drill 0.584 mm, clearance 0.203 mm